# EAGLE design XBee Pro Shield (EAGLE 7.6.0)
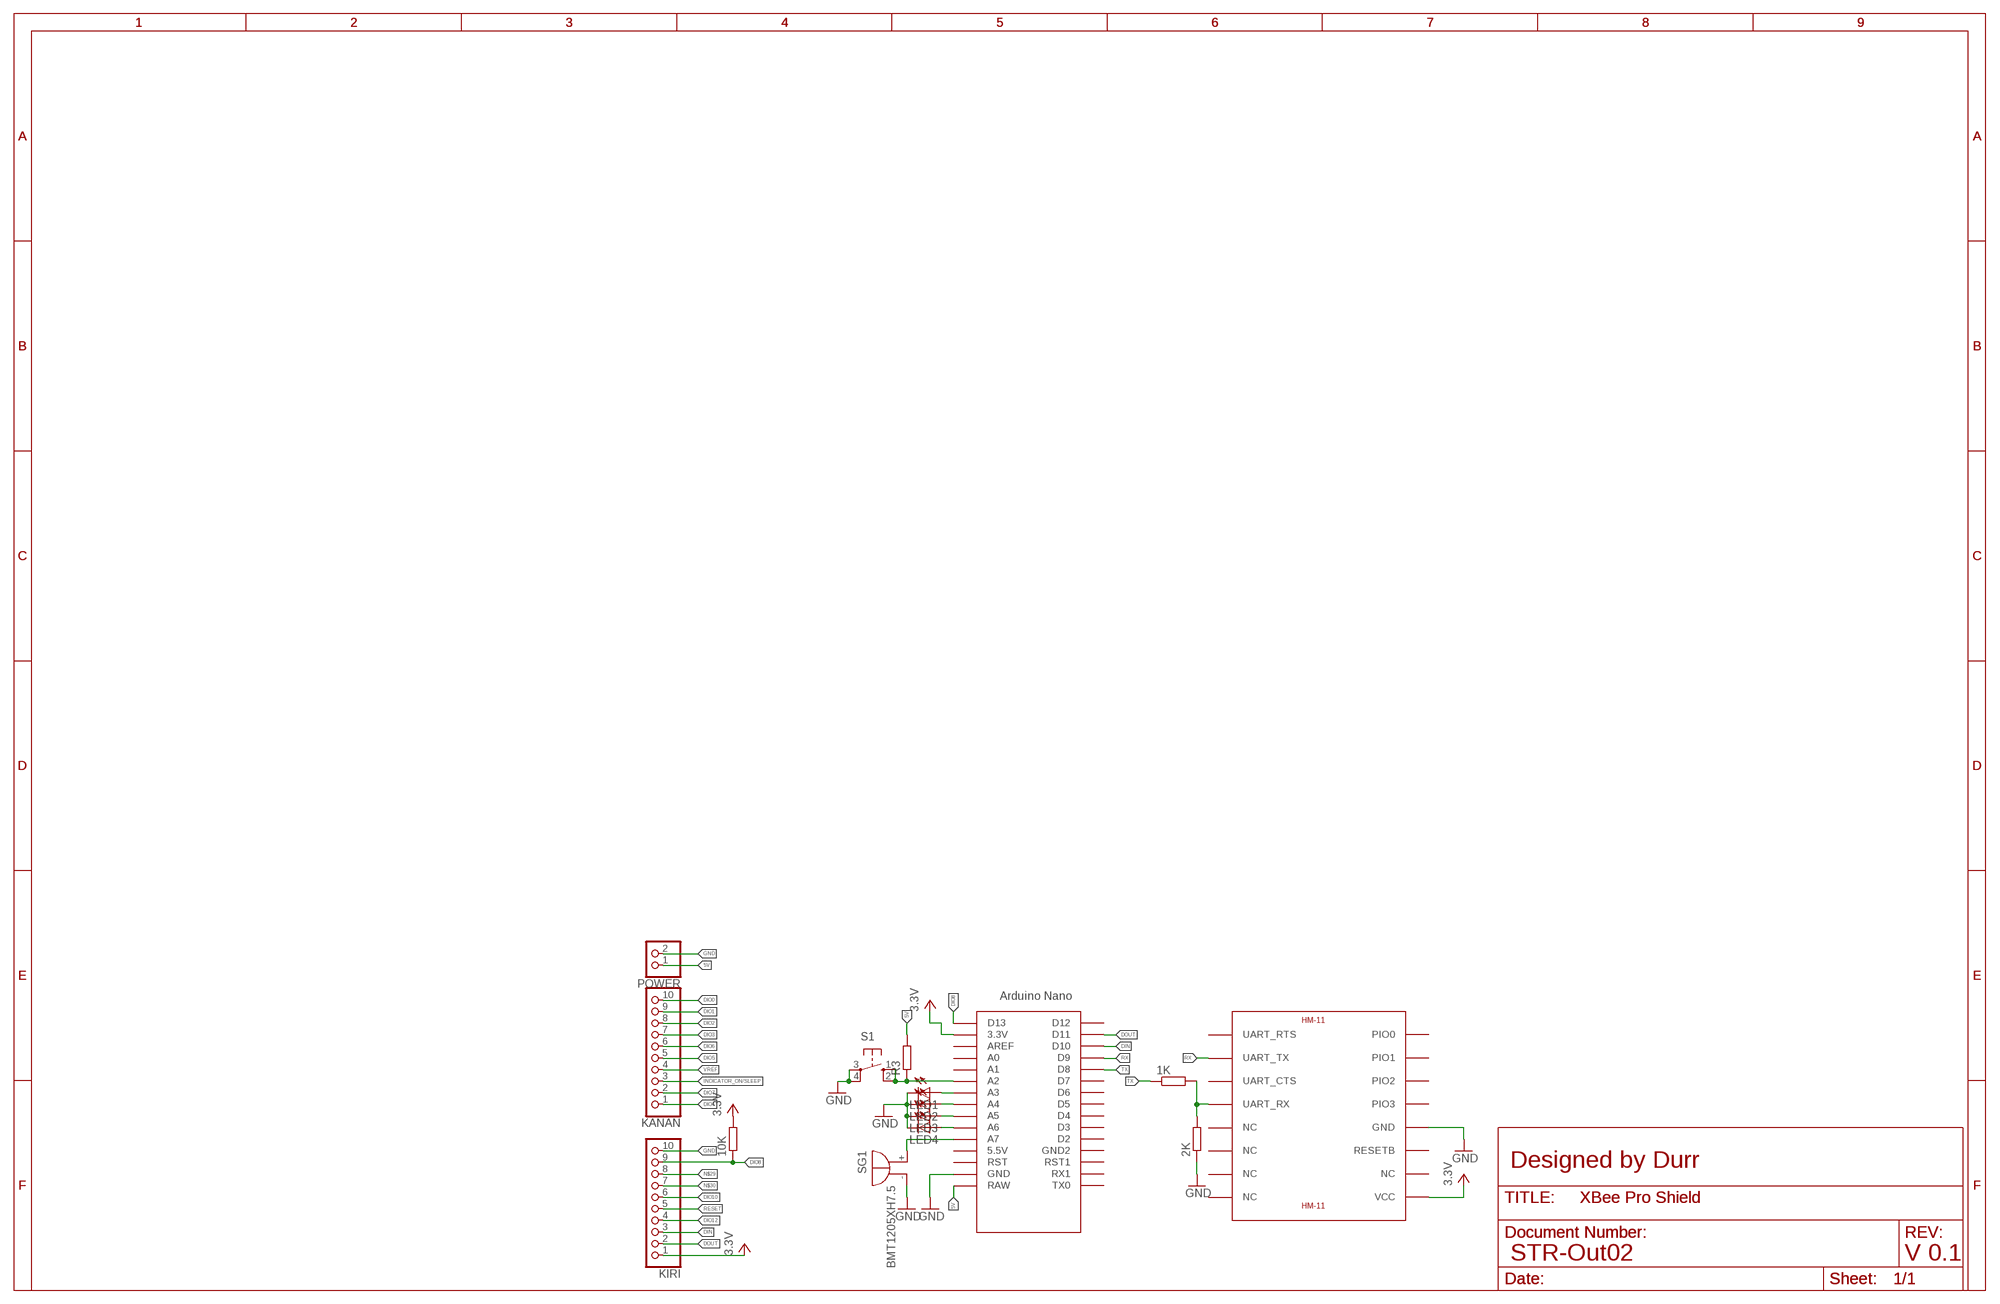
[diagram p0: schematic, sheet 1]

## Parts
1K  R-EU_R1206  [R1206]
2K  R-EU_R1206  [R1206]
10K  R-EU_R1206  [R1206]
KANAN  PINHD-1X10  [1X10]
KIRI  PINHD-1X10  [1X10]
LED1  LED5MM  [LED5MM]
LED2  LED5MM  [LED5MM]
LED3  LED5MM  [LED5MM]
LED4  LED5MM  [LED5MM]
POWER  PINHD-1X2  [1X02]
R3  R-EU_R1206  [R1206]
S1  40-XX  [B3F-40XX]
SG1  BMT1205XH7.5  [BMT1205XH7.5]
U$1  HM-11  [HM-11]
U$2  NANO  [NANO]

## Nets
5V: POWER.1 R3.2 U$2.RAW
DIN: KIRI.3 U$2.D10
DIO0: KANAN.10
DIO1: KANAN.9
DIO2: KANAN.8
DIO3: KANAN.7
DIO4: KANAN.1
DIO5: KANAN.5
DIO6: KANAN.6
DIO7: KANAN.2
DIO8: 10K.1 KIRI.9 U$2.D13
DIO10: KIRI.6
DIO12: KIRI.4
DOUT: KIRI.2 U$2.D11
GND: 2K.1 KIRI.10 LED1.K(C) LED2.K(C) LED3.K(C) LED4.K(C) POWER.2 S1.3(P) S1.4(P1) SG1.- U$1.GND U$2.GND
INDICATOR_ON/SLEEP: KANAN.3
N$2: SG1.+ U$2.A7
N$3: 1K.2 2K.2 U$1.UART_RX
N$4: LED1.A U$2.A3
N$5: R3.1 S1.1(S) S1.2(S1) U$2.A2
N$6: LED4.A U$2.A6
N$7: LED3.A U$2.A5
N$8: LED2.A U$2.A4
N$29: KIRI.8
N$30: KIRI.7
RESET: KIRI.5
RX: U$1.UART_TX U$2.D9
TX: 1K.1 U$2.D8
VCC: 10K.2 KIRI.1 U$1.VCC U$2.3.3V ; supply symbol labelled 3.3V
VREF: KANAN.4
Unconnected: U$1.NC@5(NC) U$1.NC@6(NC) U$1.NC@7(NC) U$1.NC@8(NC) U$1.NC@10(NC) U$1.PIO0 U$1.PIO1 U$1.PIO2 U$1.PIO3 U$1.RESETB U$1.UART_CTS U$1.UART_RTS U$2.5V(5.5V) U$2.A0 U$2.A1 U$2.AREF U$2.D2 U$2.D3 U$2.D4 U$2.D5 U$2.D6 U$2.D7 U$2.D12 U$2.GND1(GND2) U$2.ICSP1 U$2.ICSP2 U$2.ICSP3 U$2.ICSP4 U$2.ICSP5 U$2.ICSP6 U$2.RST U$2.RST1 U$2.RX1 U$2.TX0

## Notes on the sheet
- Designed by Durr
- STR-Out02 | V 0.1

## Library data of the parts
1K 2K 10K R3 = rcl:R-EU_: RESISTOR, European symbol
KANAN KIRI = pinhead:PINHD-1X10: PIN HEADER
LED1-LED4 = led:LED: LED OSRAM: - CHIPLED LG R971, LG N971, LY N971, LG Q971, LY Q971, LO R971, LY R971 LH N974, LH R974 LS Q976, LO Q976, LY Q976 LO Q996 - Hyper CHIPLED LW Q18S LB Q993, LB Q99A, LB R99A - SideLED LS A670, LO A670, LY A670, LG A670, LP A670 LB A673, LV A673, LT A673, LW A673 LH A674 LY A675 LS A676, LA A676, LO A676, LY A676, LW A676 LS A679, LY A679, LG A679 - Hyper Micro SIDELED® LS Y876, LA Y876, LO Y876, LY Y876 LT Y87S - SmartLED LW L88C, LW L88S LB L89C, LB L89S, LG L890 LS L89K, LO L89K, LY L89K LS L896, LA L896, LO L896, LY L896 - TOPLED LS T670, LO T670, LY T670, LG T670, LP T670 LSG T670, LSP T670, LSY T670, LOP T670, LYG T670 LG T671, LOG T671, LSG T671 LB T673, LV T673, LT T673, LW T673 LH T674 LS T676, LA T676, LO T676, LY T676, LB T676, LH T676, LSB T676, LW T676 LB T67C, LV T67C, LT T67C, LS T67K, LO T67K, LY T67K, LW E67C LS E67B, LA E67B, LO E67B, LY E67B, LB E67C, LV E67C, LT E67C LW T67C LS T679, LY T679, LG T679 LS T770, LO T770, LY T770, LG T770, LP T770 LB T773, LV T773, LT T773, LW T773 LH T774 LS E675, LA E675, LY E675, LS T675 LS T776, LA T776, LO T776, LY T776, LB T776 LHGB T686 LT T68C, LB T68C - Hyper Mini TOPLED® LB M676 - Mini TOPLED Santana® LG M470 LS M47K, LO M47K, LY M47K Source: http://www.osram.convergy.de LUXEON: - LUMILED® LXK2-PW12-R00, LXK2-PW12-S00, LXK2-PW14-U00, LXK2-PW14-V00 LXK2-PM12-R00, LXK2-PM12-S00, LXK2-PM14-U00 LXK2-PE12-Q00, LXK2-PE12-R00, LXK2-PE12-S00, LXK2-PE14-T00, LXK2-PE14-U00 LXK2-PB12-K00, LXK2-PB12-L00, LXK2-PB12-M00, LXK2-PB14-N00, LXK2-PB14-P00, LXK2-PB14-Q00 LXK2-PR12-L00, LXK2-PR12-M00, LXK2-PR14-Q00, LXK2-PR14-R00 LXK2-PD12-Q00, LXK2-PD12-R00, LXK2-PD12-S00 LXK2-PH12-R00, LXK2-PH12-S00 LXK2-PL12-P00, LXK2-PL12-Q00, LXK2-PL12-R00 Source: www.luxeon.com KINGBRIGHT: KA-3528ASYC Source: www.kingbright.com
POWER = pinhead:PINHD-1X2: PIN HEADER
S1 = switch-omron:40-XX: OMRON SWITCH; MF: OMRON COMPONENTS USA; MPN: B3F-4000; OC_FARNELL: 176434; OC_NEWARK: 36K3105
SG1 = buzzer:BMT1205XH7.5: MAGNETIC TRANSDUCER Source: Http:www.be-star.com; OC_FARNELL: unknown; OC_NEWARK: unknown
U$1 = hm-11:HM-11: JNHuaMao HM-11 Bluetooth 4.0 Transceiver based on TI CC2540/CC2541
U$2 = Arduino-clone:NANO: Arduino Nano

## Board
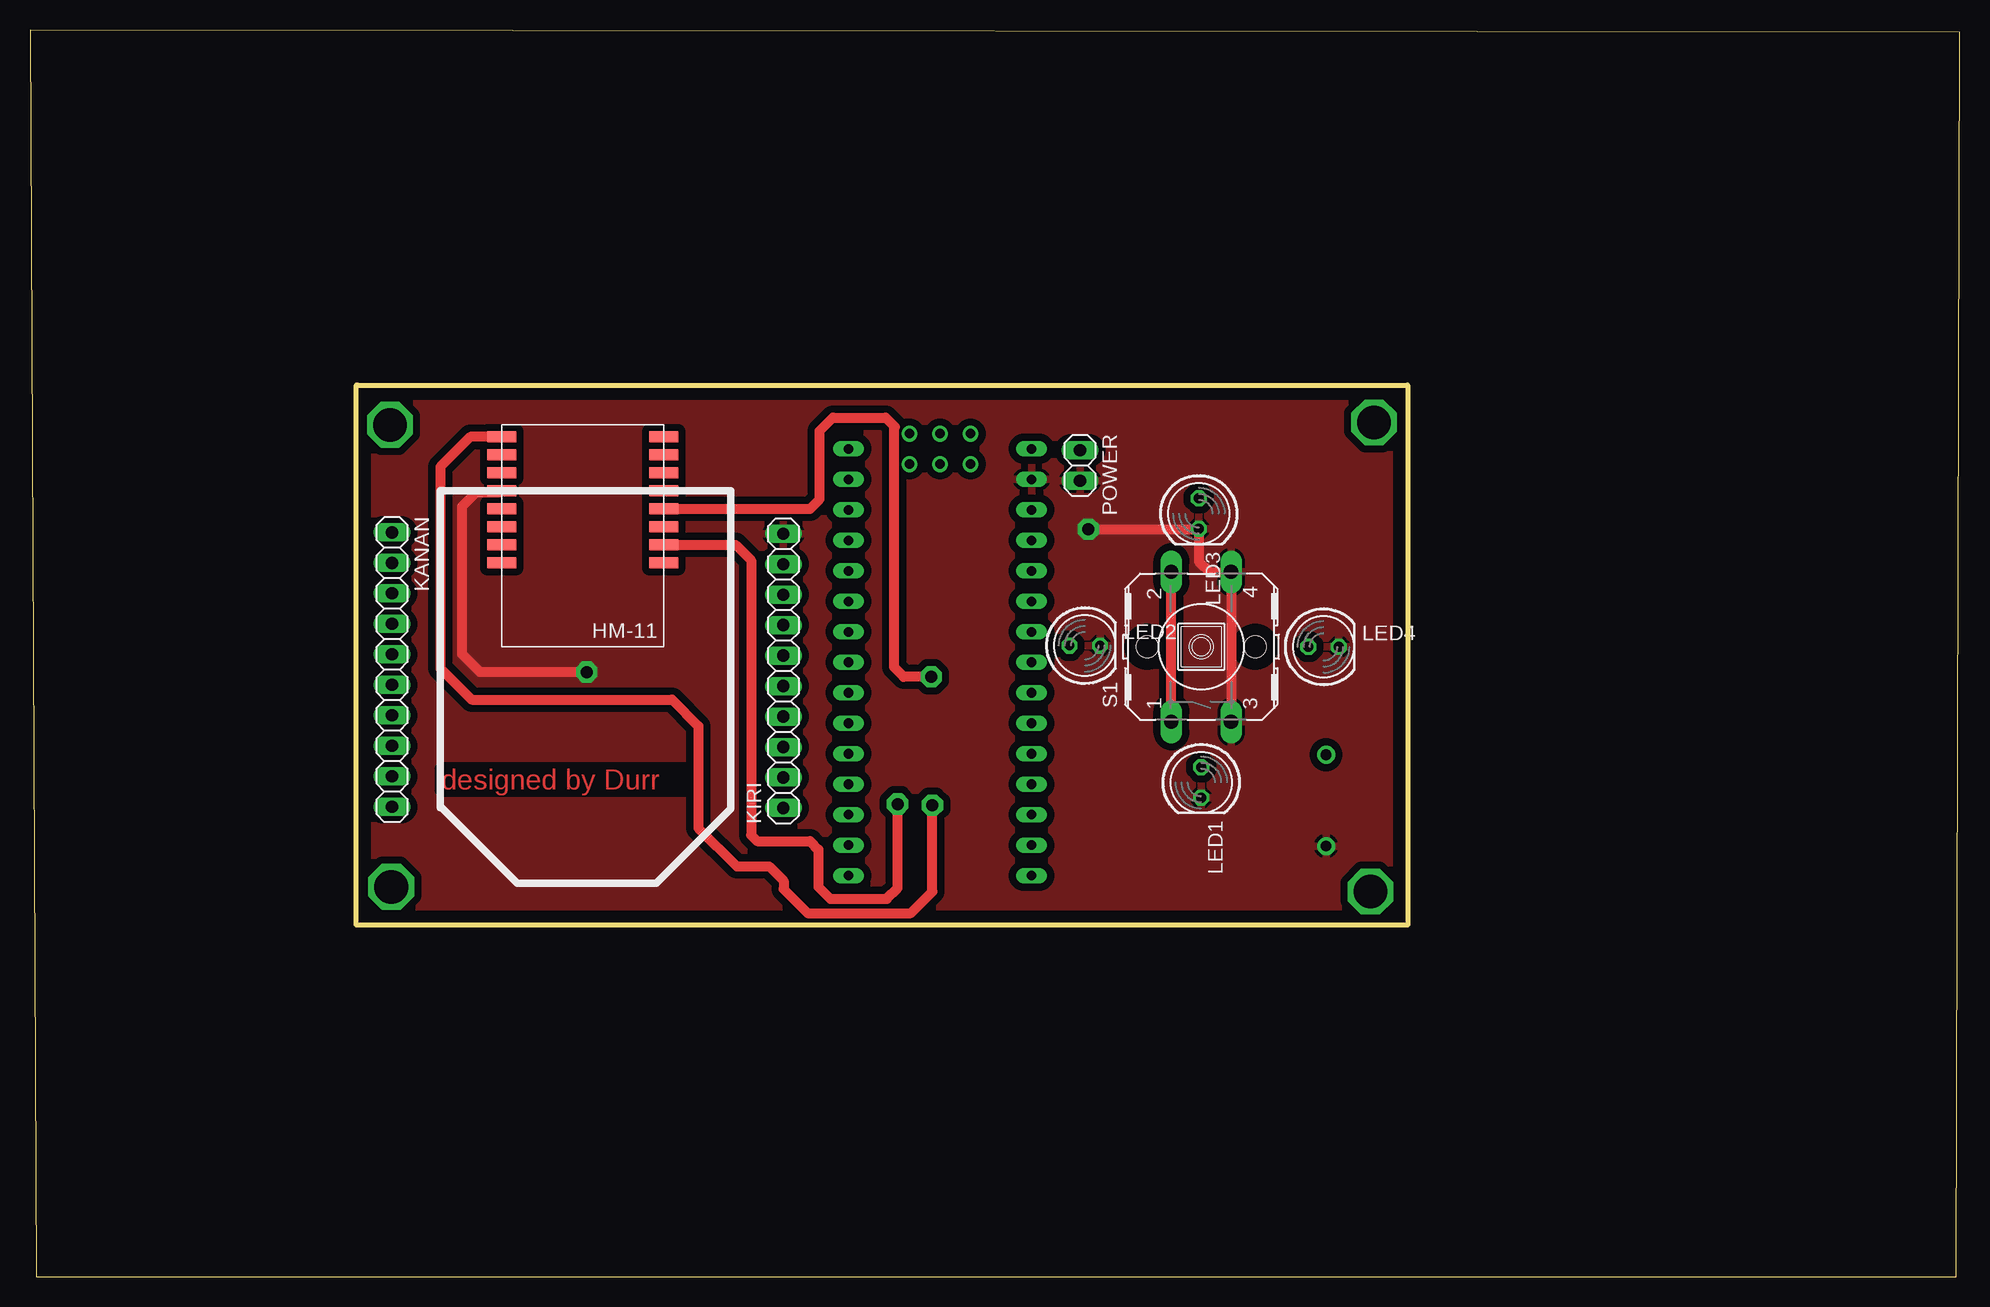
[diagram p1: board, top side]
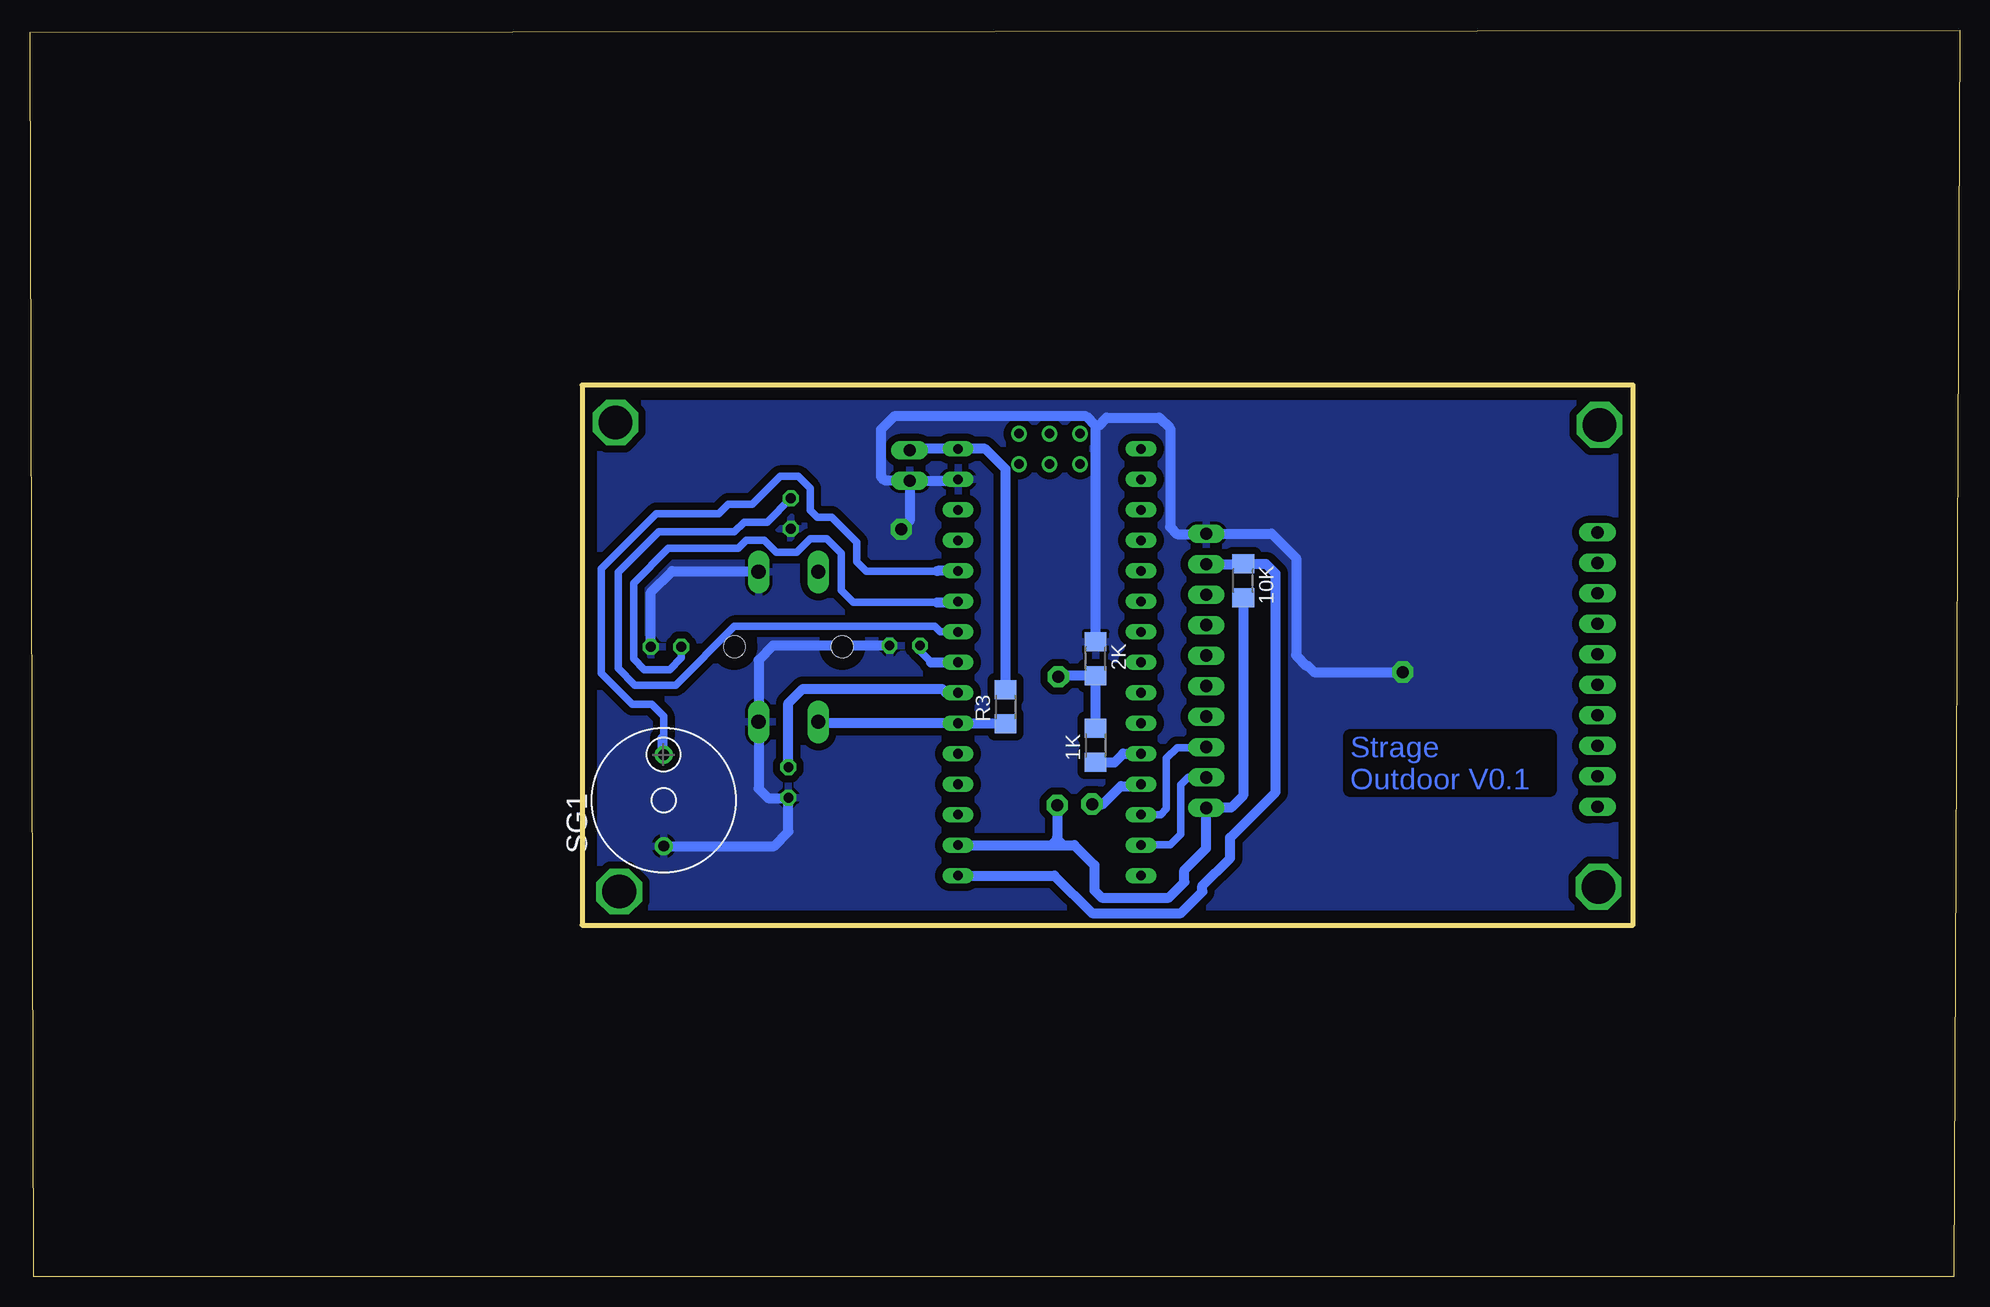
[diagram p2: board, bottom side, seen from below]

Size 160.8 x 103.9 mm. Coordinates in mm from the lower left corner, seen from the top.
Outline: 27.3,74.3 114.8,74.3 114.8,29.3 27.2,29.3 27.2,74.3
Outline: 0.5,0 160.5,0 160.8,103.7 0,103.9 0.5,0
Copper layers (1*16): Top 0.035mm / dielectric 1.5mm / Bottom 0.035mm
Design rules "default": minimum track width 10mil, minimum drill 24mil, track to track 8mil, track to pad 8mil, pad to pad 8mil, via to via 8mil, smd to smd 8mil, copper to edge 40mil, drill to drill 8mil, minimum pad ring 10mil, minimum via ring 8mil, stop-mask expansion 4mil, vias tented up to drill 0mil, thermal gap 10mil

### Footprints (pad centres in the part's own frame; a part is rotated, then mirrored left to right if it is on the bottom)
R1206 = smd 1.6 x 1.803: 1 -1.422,0; 2 1.422,0
1X10 = drill 1.016 long: 1 -11.43,0; 2 -8.89,0; 3 -6.35,0; 4 -3.81,0; 5 -1.27,0; 6 1.27,0; 7 3.81,0; 8 6.35,0; 9 8.89,0; 10 11.43,0
LED5MM = drill 0.813 octagon: A -1.27,0; K 1.27,0
1X02 = drill 1.016 long: 1 -1.27,0; 2 1.27,0
B3F-40XX = drill 1.194 long: 1 -6.248,2.489; 2 6.248,2.489; 3 -6.248,-2.489; 4 6.248,-2.489 | hole 1.803: 0,-4.496; 0,4.496
BMT1205XH7.5 = drill 0.9 pad 1.5: + 3.8,0; - -3.8,0
HM-11 = smd 2.4 x 0.9: GND 6.5,0; NC@5 -7,0; NC@6 -7,-1.5; NC@7 -7,-3; NC@8 -7,-4.5; NC@10 6.5,-3; PIO0 6.5,6; PIO1 6.5,4.5; PIO2 6.5,3; PIO3 6.5,1.5; RESETB 6.5,-1.5; UART_CTS -7,3; UART_RTS -7,6; UART_RX -7,1.5; UART_TX -7,4.5; VCC 6.5,-4.5
NANO = drill 0.8 long: 3.3V -10.16,24.13; 5V -10.16,-1.27; A0 -10.16,19.05; A1 -10.16,16.51; A2 -10.16,13.97; A3 -10.16,11.43; A4 -10.16,8.89; A5 -10.16,6.35; A6 -10.16,3.81; A7 -10.16,1.27; AREF -10.16,21.59; D2 5.08,1.27; D3 5.08,3.81; D4 5.08,6.35; D5 5.08,8.89; D6 5.08,11.43; D7 5.08,13.97; D8 5.08,16.51; D9 5.08,19.05; D10 5.08,21.59; D11 5.08,24.13; D12 5.08,26.67; D13 -10.16,26.67; GND -10.16,-6.35; GND1 5.08,-1.27; RAW -10.16,-8.89; RST -10.16,-3.81; RST1 5.08,-3.81; RX1 5.08,-6.35; TX0 5.08,-8.89 | drill 0.8: ICSP1 -5.08,-10.16; ICSP2 -5.08,-7.62; ICSP3 -2.54,-10.16; ICSP4 -2.54,-7.62; ICSP5 0,-10.16; ICSP6 0,-7.62

### Placement (x,y rotation side)
1K  72,44.3 90 bottom
2K  72,51.5 270 bottom
10K  59.7,58 270 bottom
KANAN  30.17,50.6 270 top
KIRI  62.78,50.5 90 top
LED1  97.6,41.2 270 top
LED2  87.9,52.6 0 top
LED3  97.4,63.6 270 top
LED4  107.8,52.5 0 top
POWER  87.5,67.6 270 top
R3  79.5,47.5 90 bottom
S1  97.6,52.5 90 top
SG1  108,39.7 90 bottom
U$1  45.8,65.5 180 top
U$2  73.3,60.1 180 top

### Tracks (layer width: path | path; a pad name or v marks a point on that pad's centre or on a via)
5V
  Bottom 0.813: R3.2 79.5,67.3 81.2,69 U$2.RAW 87.38,68.99 POWER.1
DIN
  Bottom 0.61: U$2.D10 66.59,38.51 66.1,39 66.1,43.2 65.2,44.1 62.83,44.1 KIRI.3
DIO8
  Bottom 0.813: KIRI.9 59.73,59.39 10K.1 59.68,59.4 57.8,59.4 57,58.6 57,40.4 60.8,36.6 60.8,34.9 63.1,32.6 63.1,32.1 64.9,30.3 72.3,30.3 75.43,33.43 U$2.D13
DOUT
  Bottom 0.61: KIRI.2 64.29,41.61 64.9,41 64.9,36.9 65.8,36 68.19,36 U$2.D11
GND  (via drill 1 pad 1.78)
  Top 0.813: S1.3 S1.4 100.04,58.7 98.3,58.7 97.4,59.6 LED3.K 97.37,62.3 v88.2,62.3 | v46.4,50.4 37.5,50.4 36,51.9 36,64.2 37.2,65.4 39.2,65.4 U$1.GND
  Bottom 0.813: POWER.2 83.58,66.33 U$2.GND | LED4.K 109.07,57.03 107.3,58.8 100.14,58.8 S1.4 | SG1.- 98.8,35.9 97.6,37.1 LED1.K 97.63,39.9 99.3,39.9 100.09,40.69 S1.3 100.09,51.4 98.89,52.6 LED2.K | POWER.2 87.5,63 v88.2,62.3 | 2K.1 72,70.9 | 72,70.9 72.8,71.7 88.8,71.7 89.9,70.6 89.9,66.7 89.6,66.4 87.57,66.4 POWER.2 | 72,70.9 71.8,70.9 71.1,71.6 66.7,71.6 65.8,70.7 65.8,62.5 65.2,61.9 62.81,61.9 KIRI.10 57.33,61.93 55.3,59.9 55.3,51.8 54.4,50.9 54.3,50.9 53.8,50.4 v46.4,50.4
  pour Bottom (isolate 0.61): 27.3,73.9 114.7,73.9 114.4,29.4 27,29.4
  pour Top (isolate 0.61): 27.5,73.8 114.9,73.8 114.5,29.3 27.1,29.3
N$2
  Bottom 0.61: 85.2,58.8 91.1,58.8 91.9,59.6 91.9,61.2 94,63.3 95.2,63.3 95.8,63.9 95.8,65.7 96.8,66.7 98.3,66.7 100.6,64.4 102.6,64.4 103.4,63.6 108.6,63.6 113.2,59 113.2,50.3 110.6,47.7 109,47.7 108,46.7 108,45 108.1,44.9
  Bottom 0.813: U$2.A7 85.17,58.83 85.2,58.8 | 108.1,44.9 108.1,43.6 SG1.+
N$3  (via drill 1 pad 1.78)
  Top 0.813: U$1.UART_RX 65,64 65.8,64.8 65.8,70.5 66.9,71.6 71.3,71.6 72.1,70.8 72,70.7 72,50.8 72.8,50 v75.1,50
  Bottom 0.813: 1K.2 2K.2 75.02,50.08 v75.1,50
N$4
  Bottom 0.813: LED1.A 97.6,47.8 96.4,49 84.8,49 84.5,48.7 83.49,48.7 U$2.A3
N$5
  Top 0.813: S1.1 S1.2
  Bottom 0.813: R3.1 79.55,46.13 U$2.A2 94.99,46.13 S1.1
N$6
  Bottom 0.61: LED4.A 106.53,51.57 107.5,50.6 109.6,50.6 110.5,51.5 110.5,57.8 107.6,60.7 101.8,60.7 101.1,61.4 99.6,61.4 98.6,60.4 96.9,60.4 95.8,61.5 94.4,61.5 93.2,60.3 93.2,57.2 92.2,56.2 85.2,56.2
  Bottom 0.813: 85.2,56.2 83.55,56.2 U$2.A6
N$7
  Bottom 0.61: U$2.A5 84.95,53.75 85.4,54.2 102.1,54.2 107,49.3 110.4,49.3 111.8,50.7 111.8,58.7 108.4,62.1 102.1,62.1 101.3,62.9 99.37,62.9 LED3.A
N$8
  Bottom 0.61: LED2.A 86.63,52.13 85.7,51.2
  Bottom 0.813: 85.7,51.2 U$2.A4
N$12  (via drill 2.8 pad 2.54)
  other vias: 112,71.2
N$13  (via drill 2.8 pad 2.54)
  other vias: 111.7,32.1
N$14  (via drill 2.8 pad 2.54)
  other vias: 30.1,32.5
N$15  (via drill 2.8 pad 2.54)
  other vias: 30,71
RX  (via drill 1 pad 1.78)
  Top 0.813: U$1.UART_TX 58.8,61 60.1,59.7 60.1,36.8 60.6,36.3 65,36.3 65.7,35.6 65.7,32.5 66.7,31.5 71.4,31.5 72.3,32.4 v72.3,39.4
  Bottom 0.813: v72.3,39.4 71.4,39.4 69.9,40.9 68.37,40.9 U$2.D9
TX
  Bottom 0.813: 1K.1 70.42,42.88 69.7,43.6 U$2.D8
VCC  (via drill 1 pad 1.78)
  Top 0.813: U$1.VCC 36.7,70 34.2,67.5 34.2,50.7 36.8,48.1 53.5,48.1 55.7,45.9 55.7,37.4 58.9,34.2 61.6,34.2 62.8,33 62.8,32.3 64.8,30.3 73.4,30.3 75.2,32.1 v75.2,39.3
  Bottom 0.61: 75.8,36 75.2,36.6 74.7,36.1
  Bottom 0.813: 10K.2 59.7,40.1 60.7,39.1 62.75,39.1 KIRI.1 62.8,39.05 62.8,35.7 64.6,33.9 64.6,32.9 65.9,31.6 71.5,31.6 72.1,32.2 72.1,34.3 73.77,35.97 75.2,35.97 | U$2.3.3V 75.2,35.97 | v75.2,39.3 75.2,36.6 75.2,35.97

### Text on the board
Top: designed by Durr
Bottom: Strage / Outdoor V0.1